# Altium project PM_Drive_UI.PrjPcb
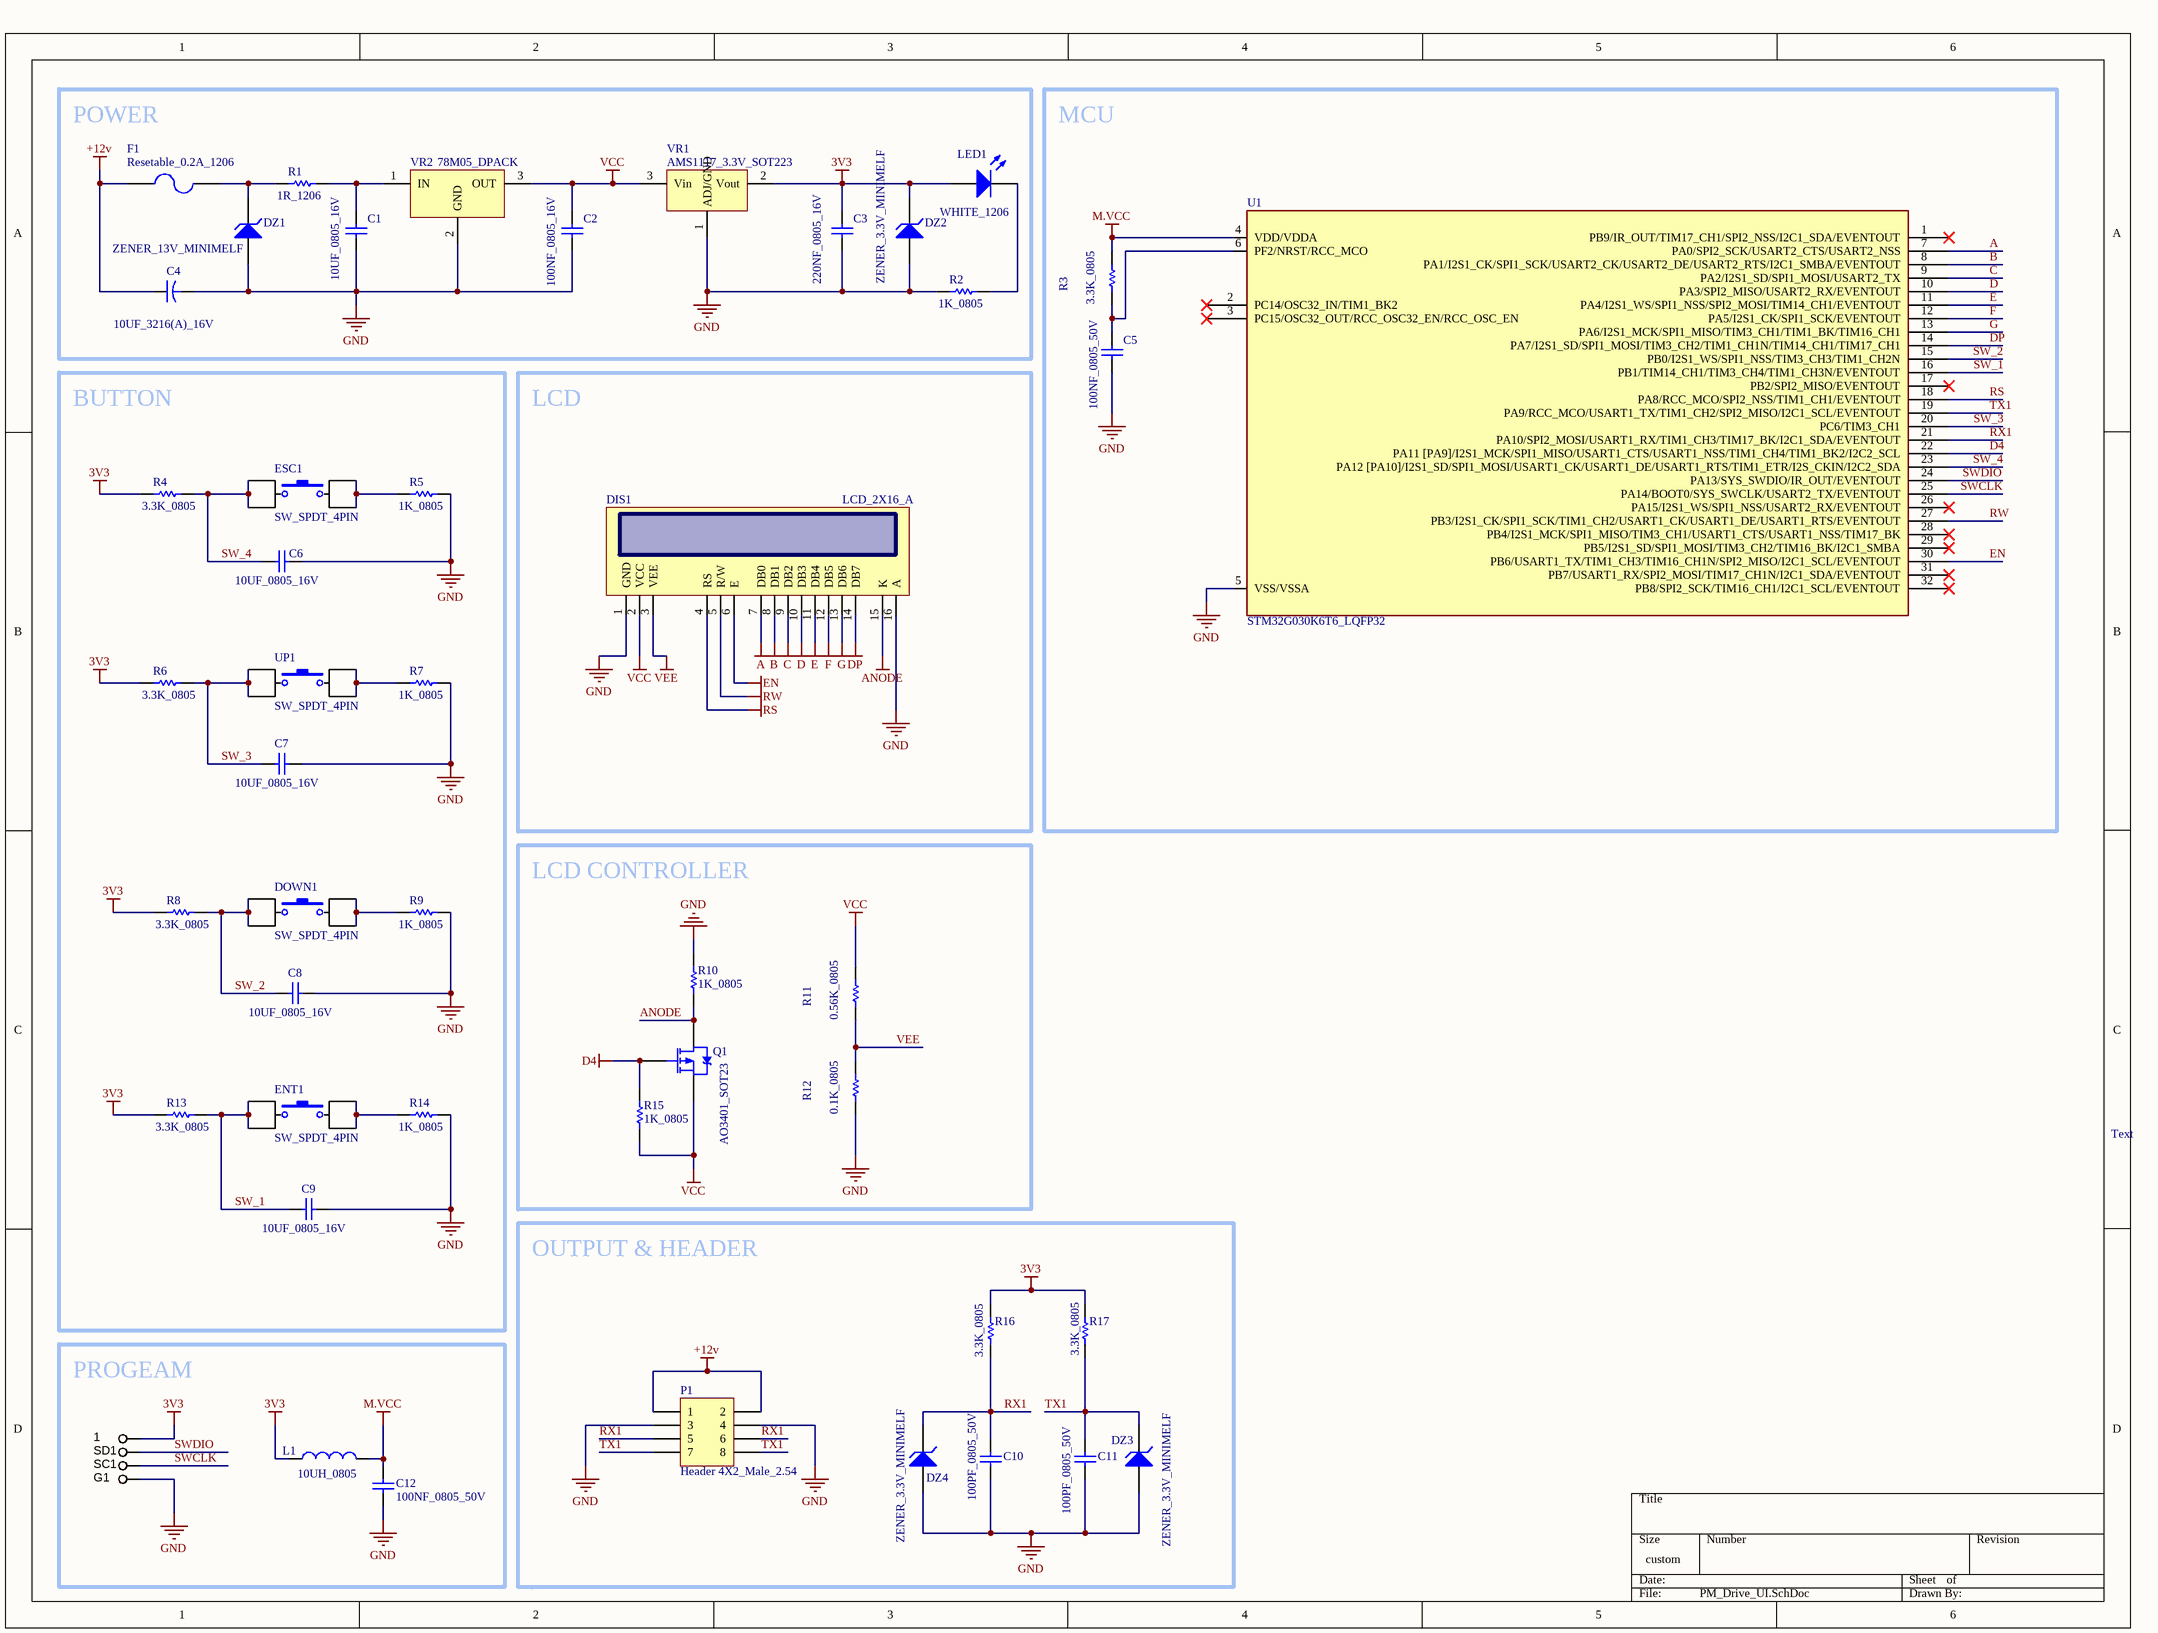
[diagram p0: PM_Drive_UI.SchDoc]
1 sheet, 50 parts. Net scope: global (net labels, ports and power ports of the same name join across sheets).
Board file: PM_Drive_UI.PcbDoc

## Sheet PM_Drive_UI.SchDoc: PM_Drive_UI
size 400 x 299 mm; Date: 1402/01/18; DrawnBy: Amirreza Salehpour

### Parts
1  (no value)  [TPSMD_D1]  (net tie, no BOM)
C1  10UF_0805_16V  [Cap_0805_Nominal]
C2  100NF_0805_16V  [Cap_0805_Nominal]
C3  220NF_0805_16V  [Cap_0805_Nominal]
C4  10UF_3216(A)_16V  [Cap_Tantal(3216)_A]
C5  100NF_0805_50V  [Cap_0805_Nominal]
C6  10UF_0805_16V  [Cap_0805_Nominal]
C7  10UF_0805_16V  [Cap_0805_Nominal]
C8  10UF_0805_16V  [Cap_0805_Nominal]
C9  10UF_0805_16V  [Cap_0805_Nominal]
C10  100PF_0805_50V  [Cap_0805_Nominal]
C11  100PF_0805_50V  [Cap_0805_Nominal]
C12  100NF_0805_50V  [Cap_0805_Nominal]
DIS1  LCD_2X16_A  [LCD_2X16_A]
DOWN1  SW_SPDT_4PIN  [SWPBS-DIP_6X6X13.5]
DZ1  ZENER_13V_MINIMELF  [Diode_ZENER_MINIMELF]
DZ2  ZENER_3.3V_MINIMELF  [Diode_ZENER_MINIMELF]
DZ3  ZENER_3.3V_MINIMELF  [Diode_ZENER_MINIMELF]
DZ4  ZENER_3.3V_MINIMELF  [Diode_ZENER_MINIMELF]
ENT1  SW_SPDT_4PIN  [SWPBS-DIP_6X6X13.5]
ESC1  SW_SPDT_4PIN  [SWPBS-DIP_6X6X13.5]
F1  Resetable_0.2A_1206  [FUSE_1206]
G1  (no value)  [TPSMD_D1]  (net tie, no BOM)
L1  10UH_0805  [INDUCTOR_0805_Nominal]
LED1  WHITE_1206  [LED_1206_NOMINAL]
P1  Header 4X2_Male_2.54  [HDR_M_2X4_2.54MM]
Q1  AO3401_SOT23  [SOT23_MOSFET]
R1  1R_1206  [Res_1206_BIG SIZE]
R2  1K_0805  [Res_0805_Nominal]
R3  3.3K_0805  [Res_0805_Nominal]
R4  3.3K_0805  [Res_0805_Nominal]
R5  1K_0805  [Res_0805_Nominal]
R6  3.3K_0805  [Res_0805_Nominal]
R7  1K_0805  [Res_0805_Nominal]
R8  3.3K_0805  [Res_0805_Nominal]
R9  1K_0805  [Res_0805_Nominal]
R10  1K_0805  [Res_0805_Nominal]
R11  0.56K_0805  [Res_0805_Nominal]
R12  0.1K_0805  [Res_0805_Nominal]
R13  3.3K_0805  [Res_0805_Nominal]
R14  1K_0805  [Res_0805_Nominal]
R15  1K_0805  [Res_0805_Nominal]
R16  3.3K_0805  [Res_0805_Nominal]
R17  3.3K_0805  [Res_0805_Nominal]
SC1  (no value)  [TPSMD_D1]  (net tie, no BOM)
SD1  (no value)  [TPSMD_D1]  (net tie, no BOM)
U1  STM32G030K6T6_LQFP32  [QFG80_32]
UP1  SW_SPDT_4PIN  [SWPBS-DIP_6X6X13.5]
VR1  AMS1117_3.3V_SOT223  [SOT223]
VR2  78M05_DPACK  [DPAK]

### Blocks framed on the sheet
POWER: C1-C4 DZ1 DZ2 F1 LED1 R1 R2 VR1 VR2
MCU: C5 R3 U1
BUTTON: C6-C9 DOWN1 ENT1 ESC1 R4-R9 R13 R14 UP1
LCD: DIS1
LCD CONTROLLER: Q1 R10-R12 R15
OUTPUT & HEADER: C10 C11 DZ3 DZ4 P1 R16 R17
PROGEAM: 1 C12 G1 L1 SC1 SD1

### Nets
3V3: 1.1 C3.2 DZ2.2(K) L1.1 LED1.1(A) R4.1 R6.1 R8.1 R13.1 R16.2 R17.2 VR1.2(Vout)
+12v: C4.1 F1.1 P1.1 P1.2
A: DIS1.7(DB0) U1.7(PA0/SPI2_SCK/USART2_CTS/USART2_NSS)
ANODE: DIS1.15(K) Q1.3(D) R10.1
B: DIS1.8(DB1) U1.8(PA1/I2S1_CK/SPI1_SCK/USART2_CK/USART2_DE/USART2_RTS/I2C1_SMBA/EVENTOUT)
C: DIS1.9(DB2) U1.9(PA2/I2S1_SD/SPI1_MOSI/USART2_TX)
D: DIS1.10(DB3) U1.10(PA3/SPI2_MISO/USART2_RX/EVENTOUT)
D4: Q1.1(G) R15.2 U1.22(PA11_[PA9]/I2S1_MCK/SPI1_MISO/USART1_CTS/USART1_NSS/TIM1_CH4/TIM1_BK2/I2C2_SCL)
DP: DIS1.14(DB7) U1.14(PA7/I2S1_SD/SPI1_MOSI/TIM3_CH2/TIM1_CH1N/TIM14_CH1/TIM17_CH1)
E: DIS1.11(DB4) U1.11(PA4/I2S1_WS/SPI1_NSS/SPI2_MOSI/TIM14_CH1/EVENTOUT)
EN: DIS1.6(E) U1.30(PB6/USART1_TX/TIM1_CH3/TIM16_CH1N/SPI2_MISO/I2C1_SCL/EVENTOUT)
F: DIS1.12(DB5) U1.12(PA5/I2S1_CK/SPI1_SCK/EVENTOUT)
G: DIS1.13(DB6) U1.13(PA6/I2S1_MCK/SPI1_MISO/TIM3_CH1/TIM1_BK/TIM16_CH1)
GND: C1.1 C2.1 C3.1 C4.2 C5.1 C6.1 C7.1 C8.1 C9.1 C10.2 C11.2 C12.2 DIS1.1(GND) DIS1.16(A) DZ1.1(A) DZ2.1(A) DZ3.1(A) DZ4.1(A) G1.1 P1.3 P1.4 R2.1 R5.2 R7.2 R9.2 R10.2 R12.1 R14.2 U1.5(VSS/VSSA) VR1.1(ADJ/GND) VR2.2(GND)
M.VCC: C12.1 L1.2 R3.2 U1.4(VDD/VDDA)
RS: DIS1.4(RS) U1.18(PA8/RCC_MCO/SPI2_NSS/TIM1_CH1/EVENTOUT)
RW: DIS1.5(R/W) U1.27(PB3/I2S1_CK/SPI1_SCK/TIM1_CH2/USART1_CK/USART1_DE/USART1_RTS/EVENTOUT)
VCC: C2.2 DIS1.2(VCC) Q1.2(S) R11.2 R15.1 VR1.3(Vin) VR2.3(OUT)
VEE: DIS1.3(VEE) R11.1 R12.2
RX1: C10.1 DZ4.2(K) P1.5 P1.6 R16.1 U1.21(PA10/SPI2_MOSI/USART1_RX/TIM1_CH3/TIM17_BK/I2C1_SDA/EVENTOUT)
SW_1: C9.2 ENT1.1 ENT1.4 R13.2 U1.16(PB1/TIM14_CH1/TIM3_CH4/TIM1_CH3N/EVENTOUT)
SW_2: C8.2 DOWN1.1 DOWN1.4 R8.2 U1.15(PB0/I2S1_WS/SPI1_NSS/TIM3_CH3/TIM1_CH2N)
SW_3: C7.2 R6.2 U1.20(PC6/TIM3_CH1) UP1.1 UP1.4
SW_4: C6.2 ESC1.1 ESC1.4 R4.2 U1.23(PA12_[PA10]/I2S1_SD/SPI1_MOSI/USART1_CK/USART1_DE/USART1_RTS/TIM1_ETR/I2S_CKIN/I2C2_SDA)
SWCLK: SC1.1 U1.25(PA14/BOOT0/SYS_SWCLK/USART2_TX/EVENTOUT)
SWDIO: SD1.1 U1.24(PA13/SYS_SWDIO/IR_OUT/EVENTOUT)
TX1: C11.1 DZ3.2(K) P1.7 P1.8 R17.1 U1.19(PA9/RCC_MCO/USART1_TX/TIM1_CH2/SPI2_MISO/I2C1_SCL/EVENTOUT)
NetC1_2: C1.2 R1.2 VR2.1(IN)
NetC5_2: C5.2 R3.1 U1.6(PF2/NRST/RCC_MCO)
NetDOWN1_2: DOWN1.2 DOWN1.3 R9.1
NetDZ1_2: DZ1.2(K) F1.2 R1.1
NetENT1_2: ENT1.2 ENT1.3 R14.1
NetESC1_2: ESC1.2 ESC1.3 R5.1
NetLED1_2: LED1.2(K) R2.2
NetR7_1: R7.1 UP1.2 UP1.3

Not connected (* = marked no-connect by the designer): U1 1(PB9/IR_OUT/TIM17_CH1/SPI2_NSS/I2C1_SDA/EVENTOUT)* 2(PC14/OSC32_IN/TIM1_BK2)* 3(PC15/OSC32_OUT/RCC_OSC32_EN/RCC_OSC_EN)* 17(PB2/SPI2_MISO/EVENTOUT)* 26(PA15/I2S1_WS/SPI1_NSS/USART2_RX/EVENTOUT)* 28(PB4/I2S1_MCK/SPI1_MISO/TIM3_CH1/USART1_CTS/USART1_NSS/TIM17_BK)* 29(PB5/I2S1_SD/SPI1_MOSI/TIM3_CH2/TIM16_BK/I2C1_SMBA)* 31(PB7/USART1_RX/SPI2_MOSI/TIM17_CH1N/I2C1_SDA/EVENTOUT)* 32(PB8/SPI2_SCK/TIM16_CH1/I2C1_SCL/EVENTOUT)*

### Notes on the sheet
- Text

### Library data of the parts
1 G1 SC1 SD1 = TESTPOINT_SMD: TEST POINT; MANF: MANF; MANF_P#: MANF_P#; VALUE: VALUE
C1-C3 C5-C12 = Cap: Value: 100nF; Component ID: 000401
C4 = Cap_Electrical: value: 100UF_25V_5*5.8
DZ1-DZ4 = Diode_Zener
F1 = FUSE
L1 = Inductor: Component ID: 003143
LED1 = LED: Component ID: 000517
P1 = Header 4X2: Header, 6-Pin, Dual row; LatestRevisionDate: 17-Jul-2002; LatestRevisionNote: Re-released for DXP Platform.; Publisher: Altium Limited
Q1 = MOSFET-P: P-Channel MOSFET; Published: 8-Jun-2000; LatestRevisionDate: 17-Jul-2002; LatestRevisionNote: Re-released for DXP Platform.; PackageVersion: 1995/1996; PackageReference: E3; Publisher: Altium Limited; PackageDescription: TO, Flat Index; 3 In-Line, Axial Leads; Body Dia. 4.6mm; Lead Dia. 0.5 mm (max)
R1-R17 = RES: Value: 10K_0603; Component ID: 000091
U1 = STM32G030K6T6: MCU, STM32, Arm® Cortex®-M0+ 32-bit MCU, 32KB FLASH, 8KB SRAM, 64 MHz CPU, 2x USART, timers, ADC, comm. I/Fs, 2.0-3.6V; DESC: 64MHz, I2C, SPI, USART; MANF: ST; PARAM2: 2~3.6VCC, 64MHz, 12Bit ADC; PARAM: 32KB FLASH,8KB SRAM, -40~85°C; MANF_P#: STM32G030K6T6; PRICE: 1$; VALUE: STM32G030K6T6
VR1 = AMS1117
VR2 = 78M05